# Altium schematic sheet Main.SchDoc
size A4
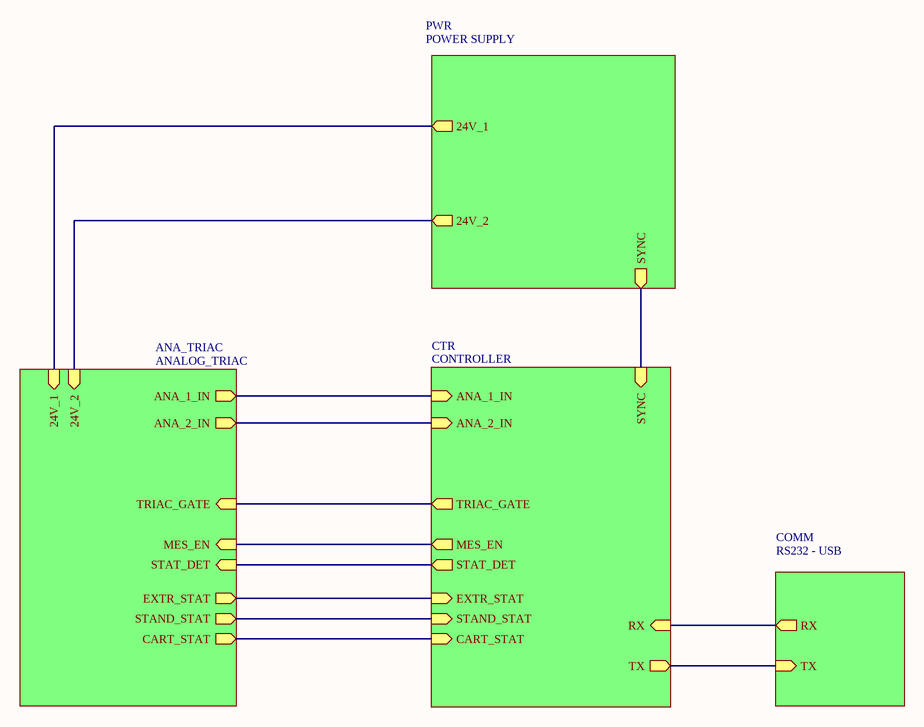
[diagram p0: Main.SchDoc]

## Sub-sheets
ANA_TRIAC = ANALOG_TRIAC: ANA_1_IN (out), CART_STAT (out), ANA_2_IN (out), STAND_STAT (out), EXTR_STAT (out), STAT_DET (in), 24V_1 (in), 24V_2 (in), TRIAC_GATE (in), MES_EN (in)
COMM = RS232 - USB: RX (out), TX (in)
CTR = CONTROLLER: STAT_DET (out), ANA_1_IN (in), RX (in), TX (out), SYNC (in), ANA_2_IN (in), TRIAC_GATE (out), EXTR_STAT (in), STAND_STAT (in), CART_STAT (in), MES_EN (out)
PWR = POWER SUPPLY: SYNC (out), 24V_1 (out), 24V_2 (out)

## Nets
(unnamed): sheet CTR/STAT_DET, sheet ANA_TRIAC/STAT_DET
(unnamed): sheet CTR/ANA_1_IN, sheet ANA_TRIAC/ANA_1_IN
(unnamed): sheet CTR/RX, sheet COMM/RX
(unnamed): sheet CTR/TX, sheet COMM/TX
(unnamed): sheet CTR/SYNC, sheet PWR/SYNC
(unnamed): sheet CTR/ANA_2_IN, sheet ANA_TRIAC/ANA_2_IN
(unnamed): sheet CTR/TRIAC_GATE, sheet ANA_TRIAC/TRIAC_GATE
(unnamed): sheet CTR/EXTR_STAT, sheet ANA_TRIAC/EXTR_STAT
(unnamed): sheet CTR/STAND_STAT, sheet ANA_TRIAC/STAND_STAT
(unnamed): sheet CTR/CART_STAT, sheet ANA_TRIAC/CART_STAT
(unnamed): sheet CTR/MES_EN, sheet ANA_TRIAC/MES_EN
(unnamed): sheet PWR/24V_1, sheet ANA_TRIAC/24V_1
(unnamed): sheet PWR/24V_2, sheet ANA_TRIAC/24V_2